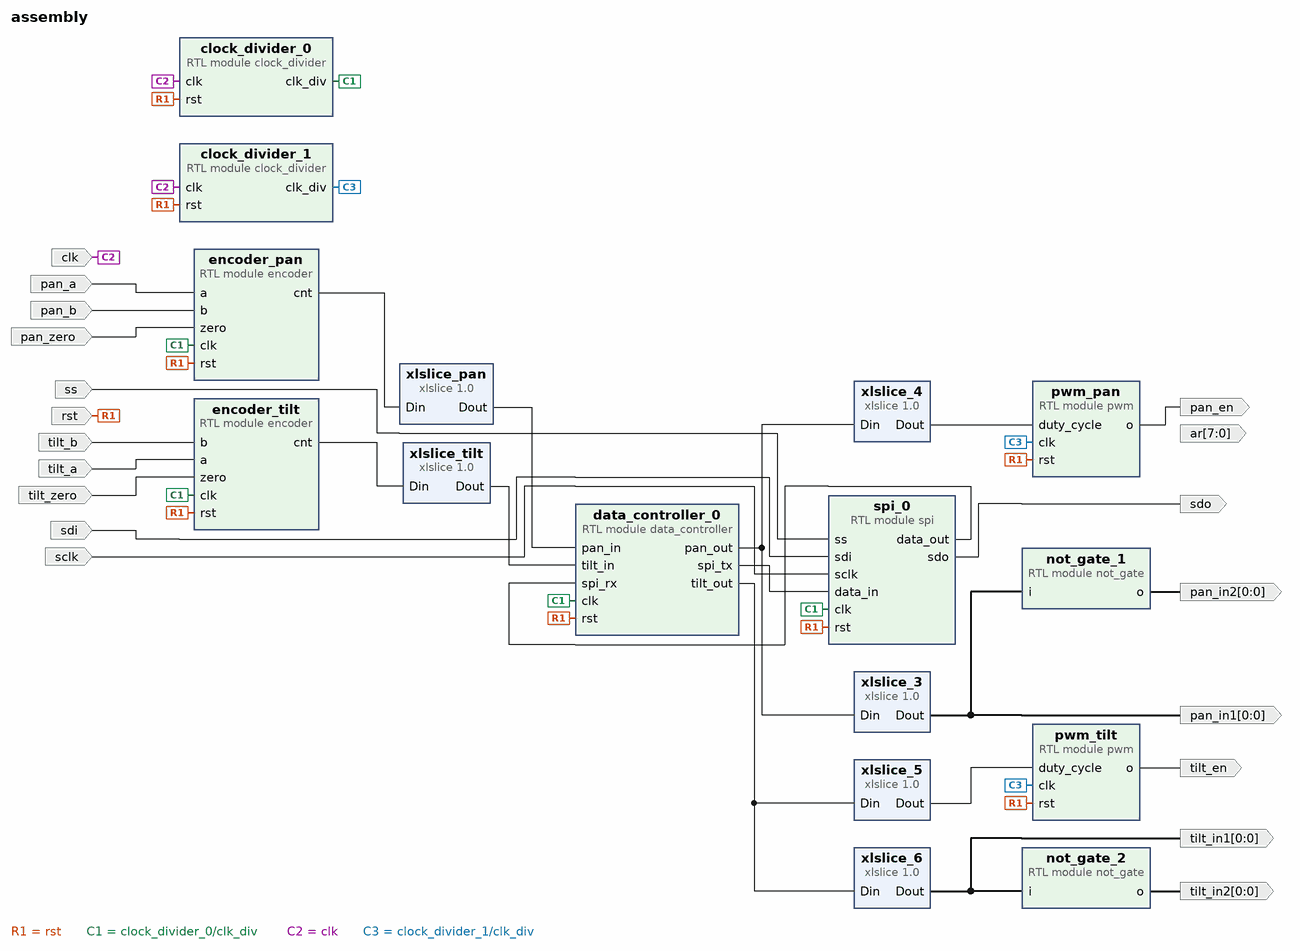
[diagram p0: block diagram of the top level]
# Vivado block design assembly, xc7z020clg400-1, Vivado 2020.2
create_bd_design assembly

create_bd_port -dir I -type clk clk
create_bd_port -dir I ss
create_bd_port -dir I sclk
create_bd_port -dir O sdo
create_bd_port -dir I sdi
create_bd_port -dir I tilt_b
create_bd_port -dir I tilt_a
create_bd_port -dir O -from 0 -to 0 pan_in1
create_bd_port -dir O -from 0 -to 0 pan_in2
create_bd_port -dir O pan_en
create_bd_port -dir I pan_b
create_bd_port -dir I pan_a
create_bd_port -dir O tilt_en
create_bd_port -dir O -from 0 -to 0 tilt_in1
create_bd_port -dir O -from 0 -to 0 tilt_in2
create_bd_port -dir O -from 7 -to 0 ar
create_bd_port -dir I rst
create_bd_port -dir I tilt_zero
create_bd_port -dir I pan_zero

create_bd_cell -type module -reference clock_divider clock_divider_0
set_property -dict {CONFIG.n_bits 6} [get_bd_cells clock_divider_0]
create_bd_cell -type ip -vlnv xilinx.com:ip:xlslice:1.0 xlslice_3
set_property -dict {CONFIG.DIN_FROM 8 CONFIG.DIN_TO 8 CONFIG.DIN_WIDTH 9 CONFIG.DOUT_WIDTH 1} [get_bd_cells xlslice_3]
create_bd_cell -type module -reference not_gate not_gate_1
create_bd_cell -type ip -vlnv xilinx.com:ip:xlslice:1.0 xlslice_4
set_property -dict {CONFIG.DIN_FROM 7 CONFIG.DIN_TO 0 CONFIG.DIN_WIDTH 9 CONFIG.DOUT_WIDTH 8} [get_bd_cells xlslice_4]
create_bd_cell -type ip -vlnv xilinx.com:ip:xlslice:1.0 xlslice_5
set_property -dict {CONFIG.DIN_FROM 7 CONFIG.DIN_TO 0 CONFIG.DIN_WIDTH 9 CONFIG.DOUT_WIDTH 8} [get_bd_cells xlslice_5]
create_bd_cell -type ip -vlnv xilinx.com:ip:xlslice:1.0 xlslice_6
set_property -dict {CONFIG.DIN_FROM 8 CONFIG.DIN_TO 8 CONFIG.DIN_WIDTH 9 CONFIG.DOUT_WIDTH 1} [get_bd_cells xlslice_6]
create_bd_cell -type module -reference not_gate not_gate_2
create_bd_cell -type module -reference spi spi_0
set_property -dict {CONFIG.data_width 16 CONFIG.sph {"1"} CONFIG.spo {"0"}} [get_bd_cells spi_0]
create_bd_cell -type module -reference clock_divider clock_divider_1
set_property -dict {CONFIG.n_bits 4} [get_bd_cells clock_divider_1]
create_bd_cell -type ip -vlnv xilinx.com:ip:xlslice:1.0 xlslice_tilt
set_property -dict {CONFIG.DIN_FROM 9 CONFIG.DIN_TO 1 CONFIG.DIN_WIDTH 10 CONFIG.DOUT_WIDTH 9} [get_bd_cells xlslice_tilt]
create_bd_cell -type ip -vlnv xilinx.com:ip:xlslice:1.0 xlslice_pan
set_property -dict {CONFIG.DIN_FROM 9 CONFIG.DIN_TO 1 CONFIG.DIN_WIDTH 10 CONFIG.DOUT_WIDTH 9} [get_bd_cells xlslice_pan]
create_bd_cell -type module -reference pwm pwm_pan
set_property -dict {CONFIG.n_bits 8} [get_bd_cells pwm_pan]
create_bd_cell -type module -reference pwm pwm_tilt
set_property -dict {CONFIG.n_bits 8} [get_bd_cells pwm_tilt]
create_bd_cell -type module -reference data_controller data_controller_0
create_bd_cell -type module -reference encoder encoder_tilt
set_property -dict {CONFIG.n_bits 10} [get_bd_cells encoder_tilt]
create_bd_cell -type module -reference encoder encoder_pan
set_property -dict {CONFIG.n_bits 10} [get_bd_cells encoder_pan]

# ---- connections ----

connect_bd_net -net ss_0_1 [get_bd_ports ss] [get_bd_pins spi_0/ss]
connect_bd_net -net sdi_0_1 [get_bd_ports sdi] [get_bd_pins spi_0/sdi]
connect_bd_net -net xlslice_0_Dout [get_bd_pins data_controller_0/pan_out] [get_bd_pins xlslice_3/Din] [get_bd_pins xlslice_4/Din]
connect_bd_net [get_bd_pins xlslice_4/Dout] [get_bd_pins pwm_pan/duty_cycle]
connect_bd_net -net pwm_0_o [get_bd_pins pwm_pan/o] [get_bd_ports pan_en]
connect_bd_net [get_bd_pins xlslice_5/Dout] [get_bd_pins pwm_tilt/duty_cycle]
connect_bd_net [get_bd_pins pwm_tilt/o] [get_bd_ports tilt_en]
connect_bd_net -net i_0_1 [get_bd_ports rst] \
  [get_bd_pins clock_divider_0/rst] [get_bd_pins spi_0/rst] [get_bd_pins clock_divider_1/rst] [get_bd_pins pwm_pan/rst] \
  [get_bd_pins pwm_tilt/rst] [get_bd_pins data_controller_0/rst] [get_bd_pins encoder_tilt/rst] [get_bd_pins encoder_pan/rst]
connect_bd_net [get_bd_ports tilt_b] [get_bd_pins encoder_tilt/b]
connect_bd_net [get_bd_ports tilt_a] [get_bd_pins encoder_tilt/a]
connect_bd_net [get_bd_pins spi_0/sdo] [get_bd_ports sdo]
connect_bd_net [get_bd_pins xlslice_6/Dout] [get_bd_pins not_gate_2/i] [get_bd_ports tilt_in1]
connect_bd_net [get_bd_pins not_gate_2/o] [get_bd_ports tilt_in2]
connect_bd_net [get_bd_pins xlslice_3/Dout] [get_bd_ports pan_in1] [get_bd_pins not_gate_1/i]
connect_bd_net [get_bd_pins not_gate_1/o] [get_bd_ports pan_in2]
connect_bd_net [get_bd_pins clock_divider_0/clk_div] \
  [get_bd_pins spi_0/clk] [get_bd_pins data_controller_0/clk] [get_bd_pins encoder_tilt/clk] [get_bd_pins encoder_pan/clk]
connect_bd_net [get_bd_ports clk] [get_bd_pins clock_divider_1/clk] [get_bd_pins clock_divider_0/clk]
connect_bd_net [get_bd_pins clock_divider_1/clk_div] [get_bd_pins pwm_pan/clk] [get_bd_pins pwm_tilt/clk]
connect_bd_net [get_bd_ports sclk] [get_bd_pins spi_0/sclk]
connect_bd_net [get_bd_ports pan_a] [get_bd_pins encoder_pan/a]
connect_bd_net [get_bd_ports pan_b] [get_bd_pins encoder_pan/b]
connect_bd_net [get_bd_pins encoder_tilt/cnt] [get_bd_pins xlslice_tilt/Din]
connect_bd_net [get_bd_pins encoder_pan/cnt] [get_bd_pins xlslice_pan/Din]
connect_bd_net -net xlslice_1_Dout [get_bd_pins xlslice_pan/Dout] [get_bd_pins data_controller_0/pan_in]
connect_bd_net [get_bd_pins data_controller_0/spi_tx] [get_bd_pins spi_0/data_in]
connect_bd_net [get_bd_pins spi_0/data_out] [get_bd_pins data_controller_0/spi_rx]
connect_bd_net [get_bd_pins data_controller_0/tilt_out] [get_bd_pins xlslice_6/Din] [get_bd_pins xlslice_5/Din]
connect_bd_net [get_bd_pins xlslice_tilt/Dout] [get_bd_pins data_controller_0/tilt_in]
connect_bd_net [get_bd_ports pan_zero] [get_bd_pins encoder_pan/zero]
connect_bd_net [get_bd_ports tilt_zero] [get_bd_pins encoder_tilt/zero]

validate_bd_design
save_bd_design
